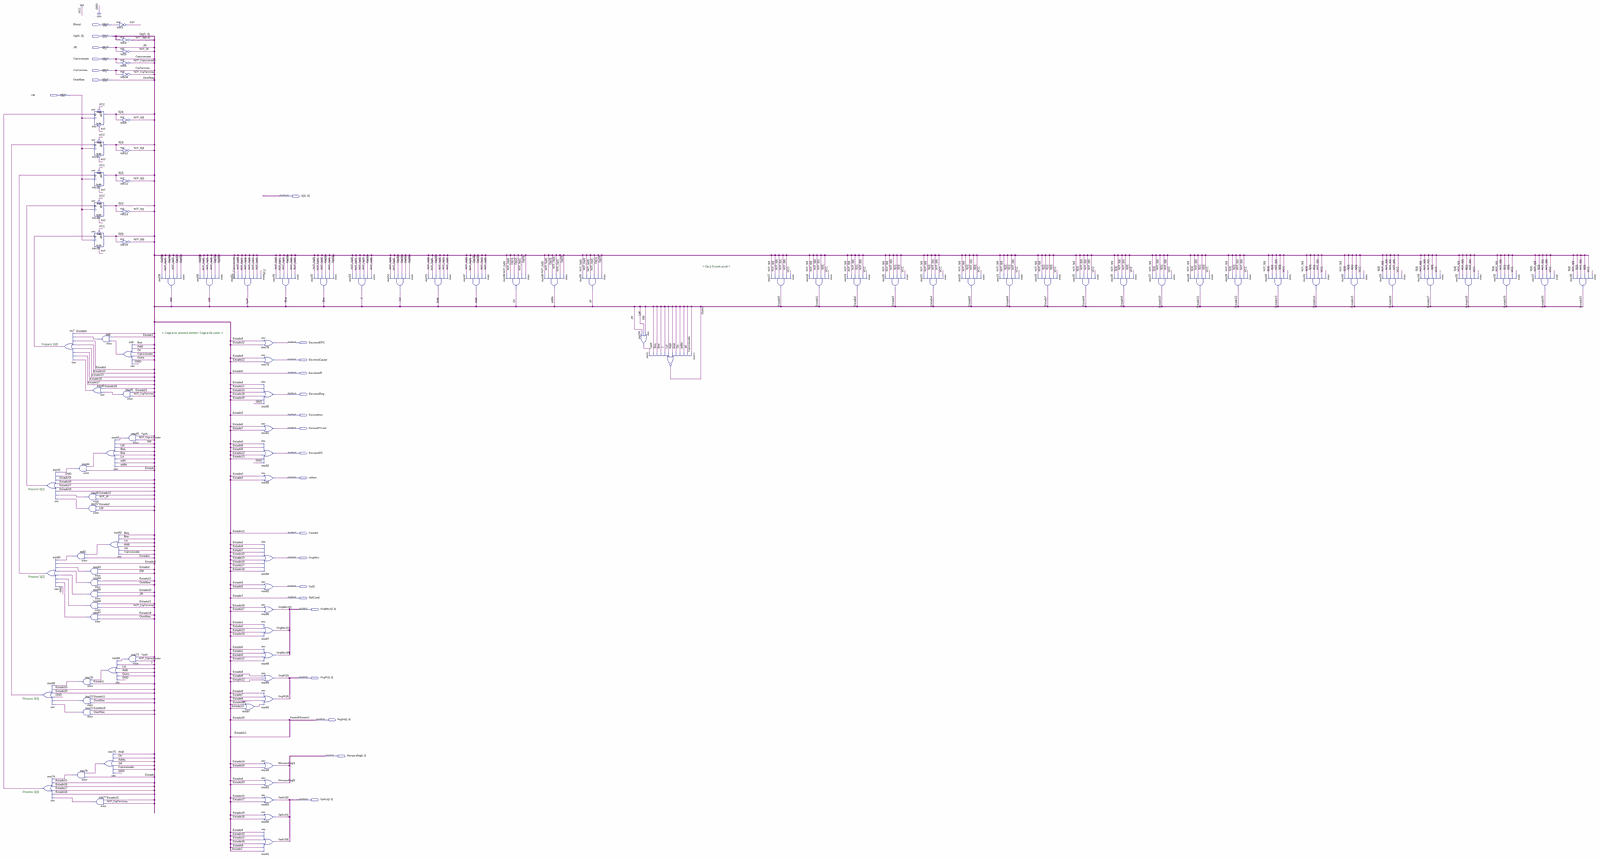
[diagram p0: schematic sheet, whole]
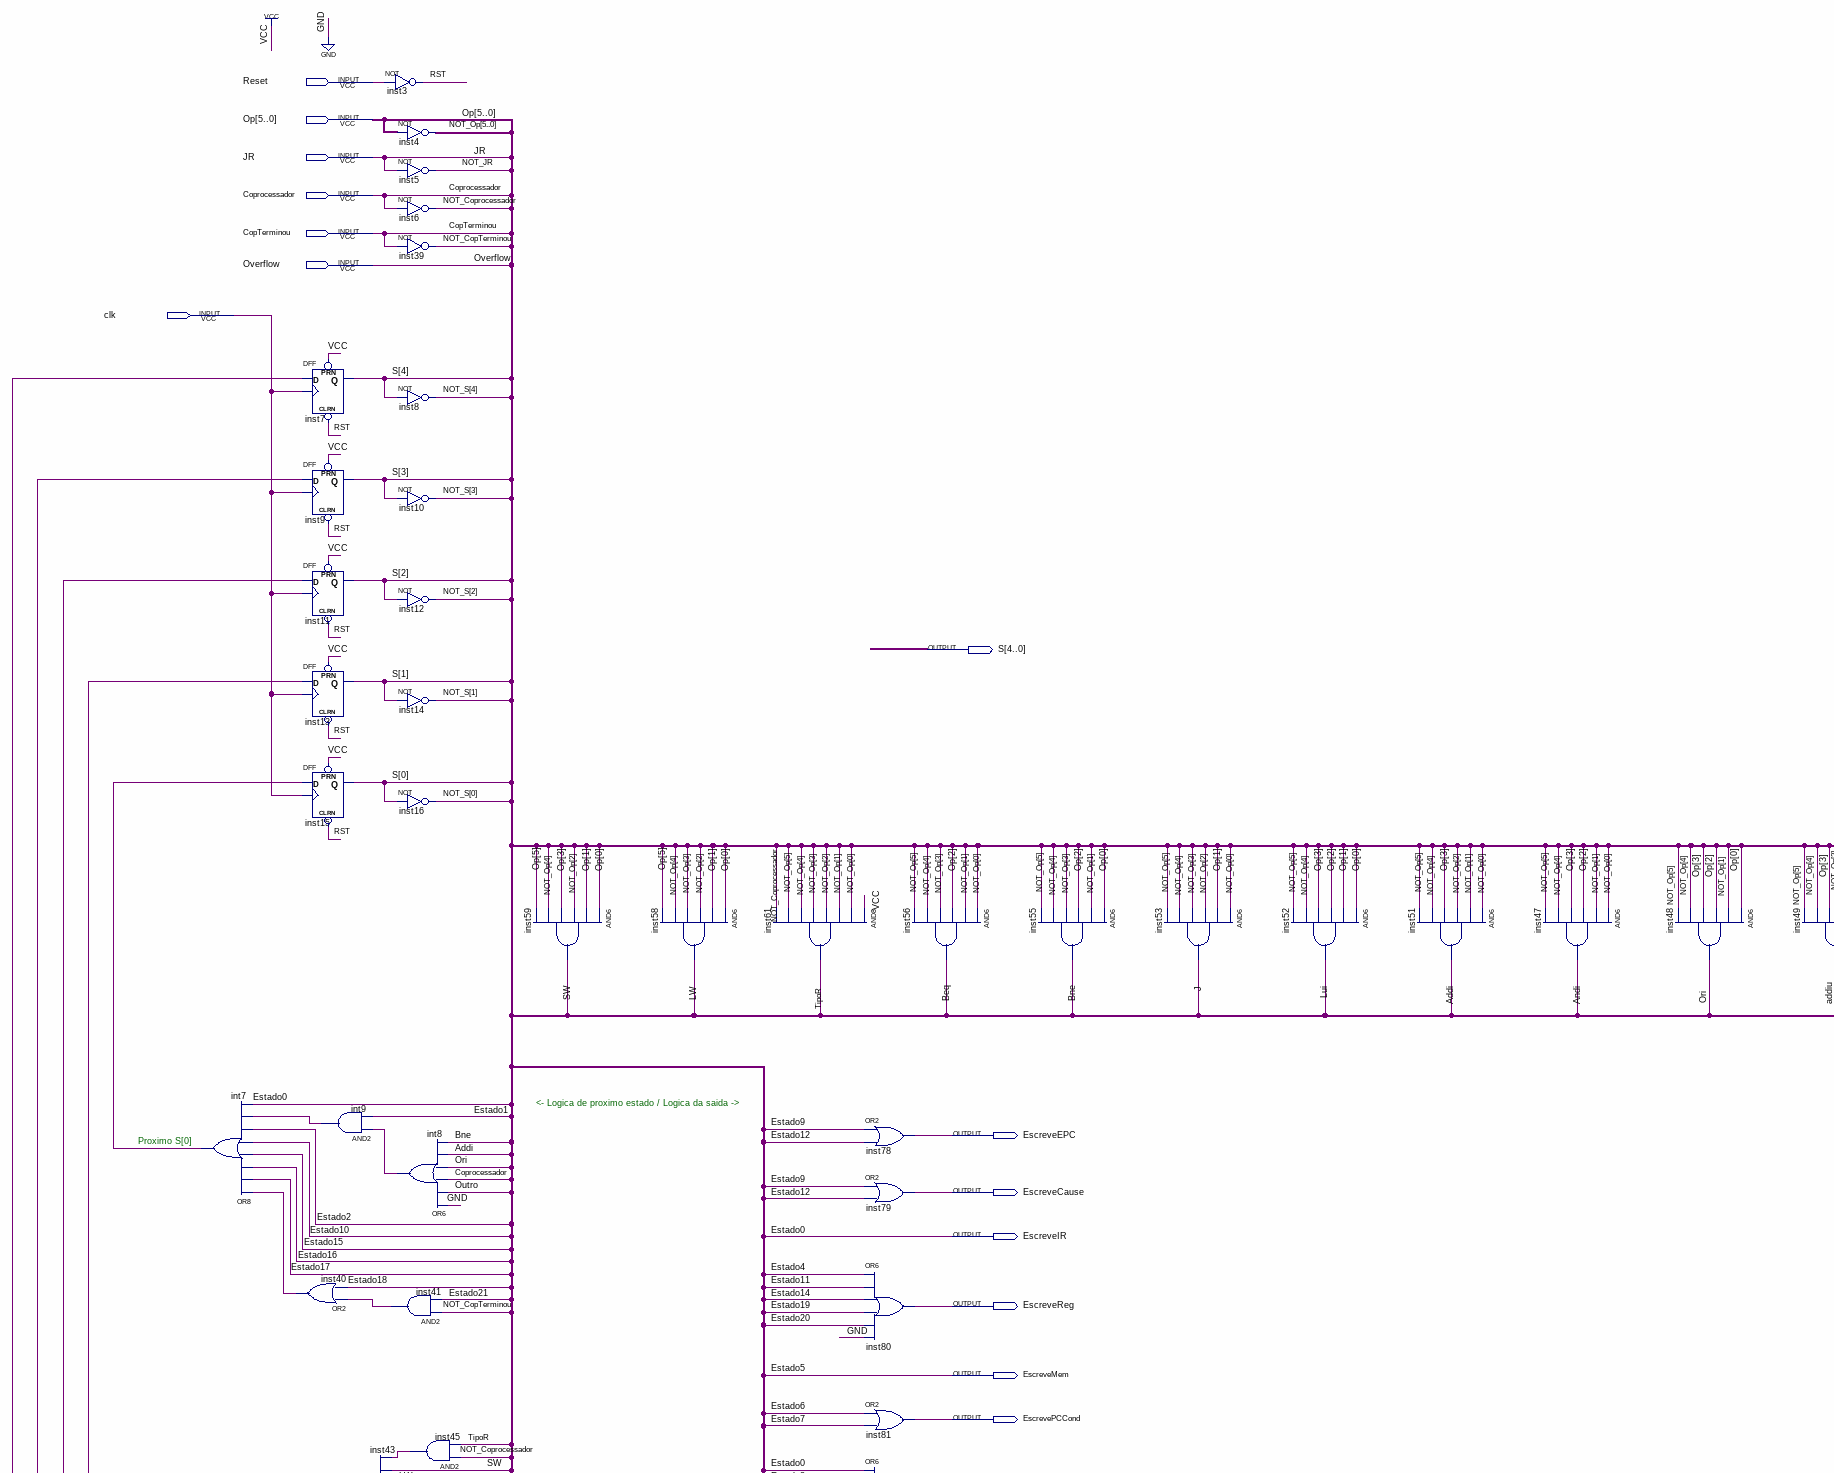
[diagram p1: schematic sheet, upper left part]
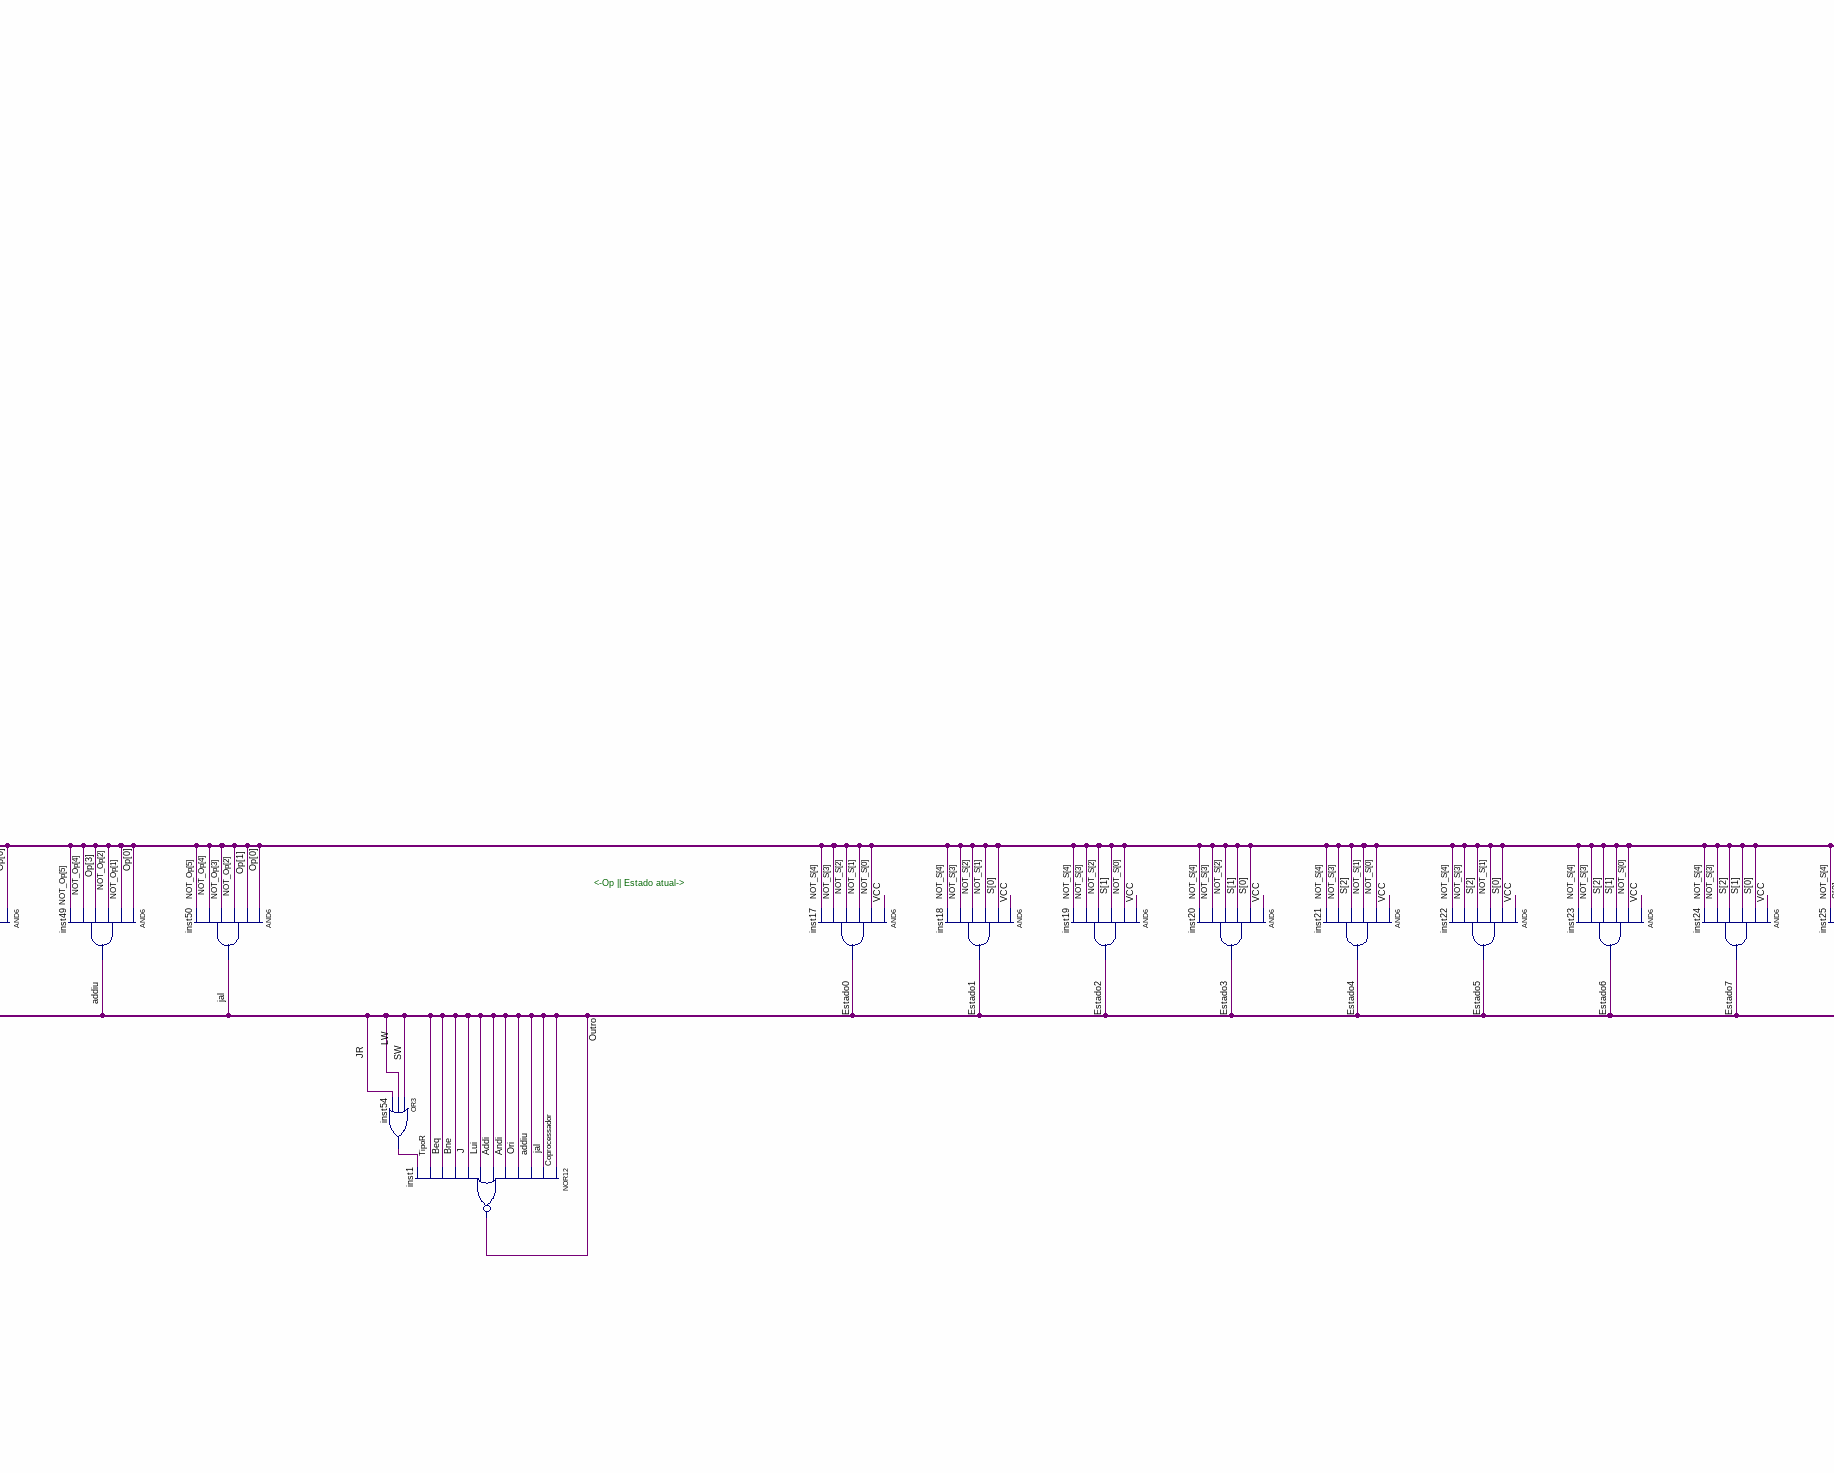
[diagram p2: schematic sheet, upper centre part]
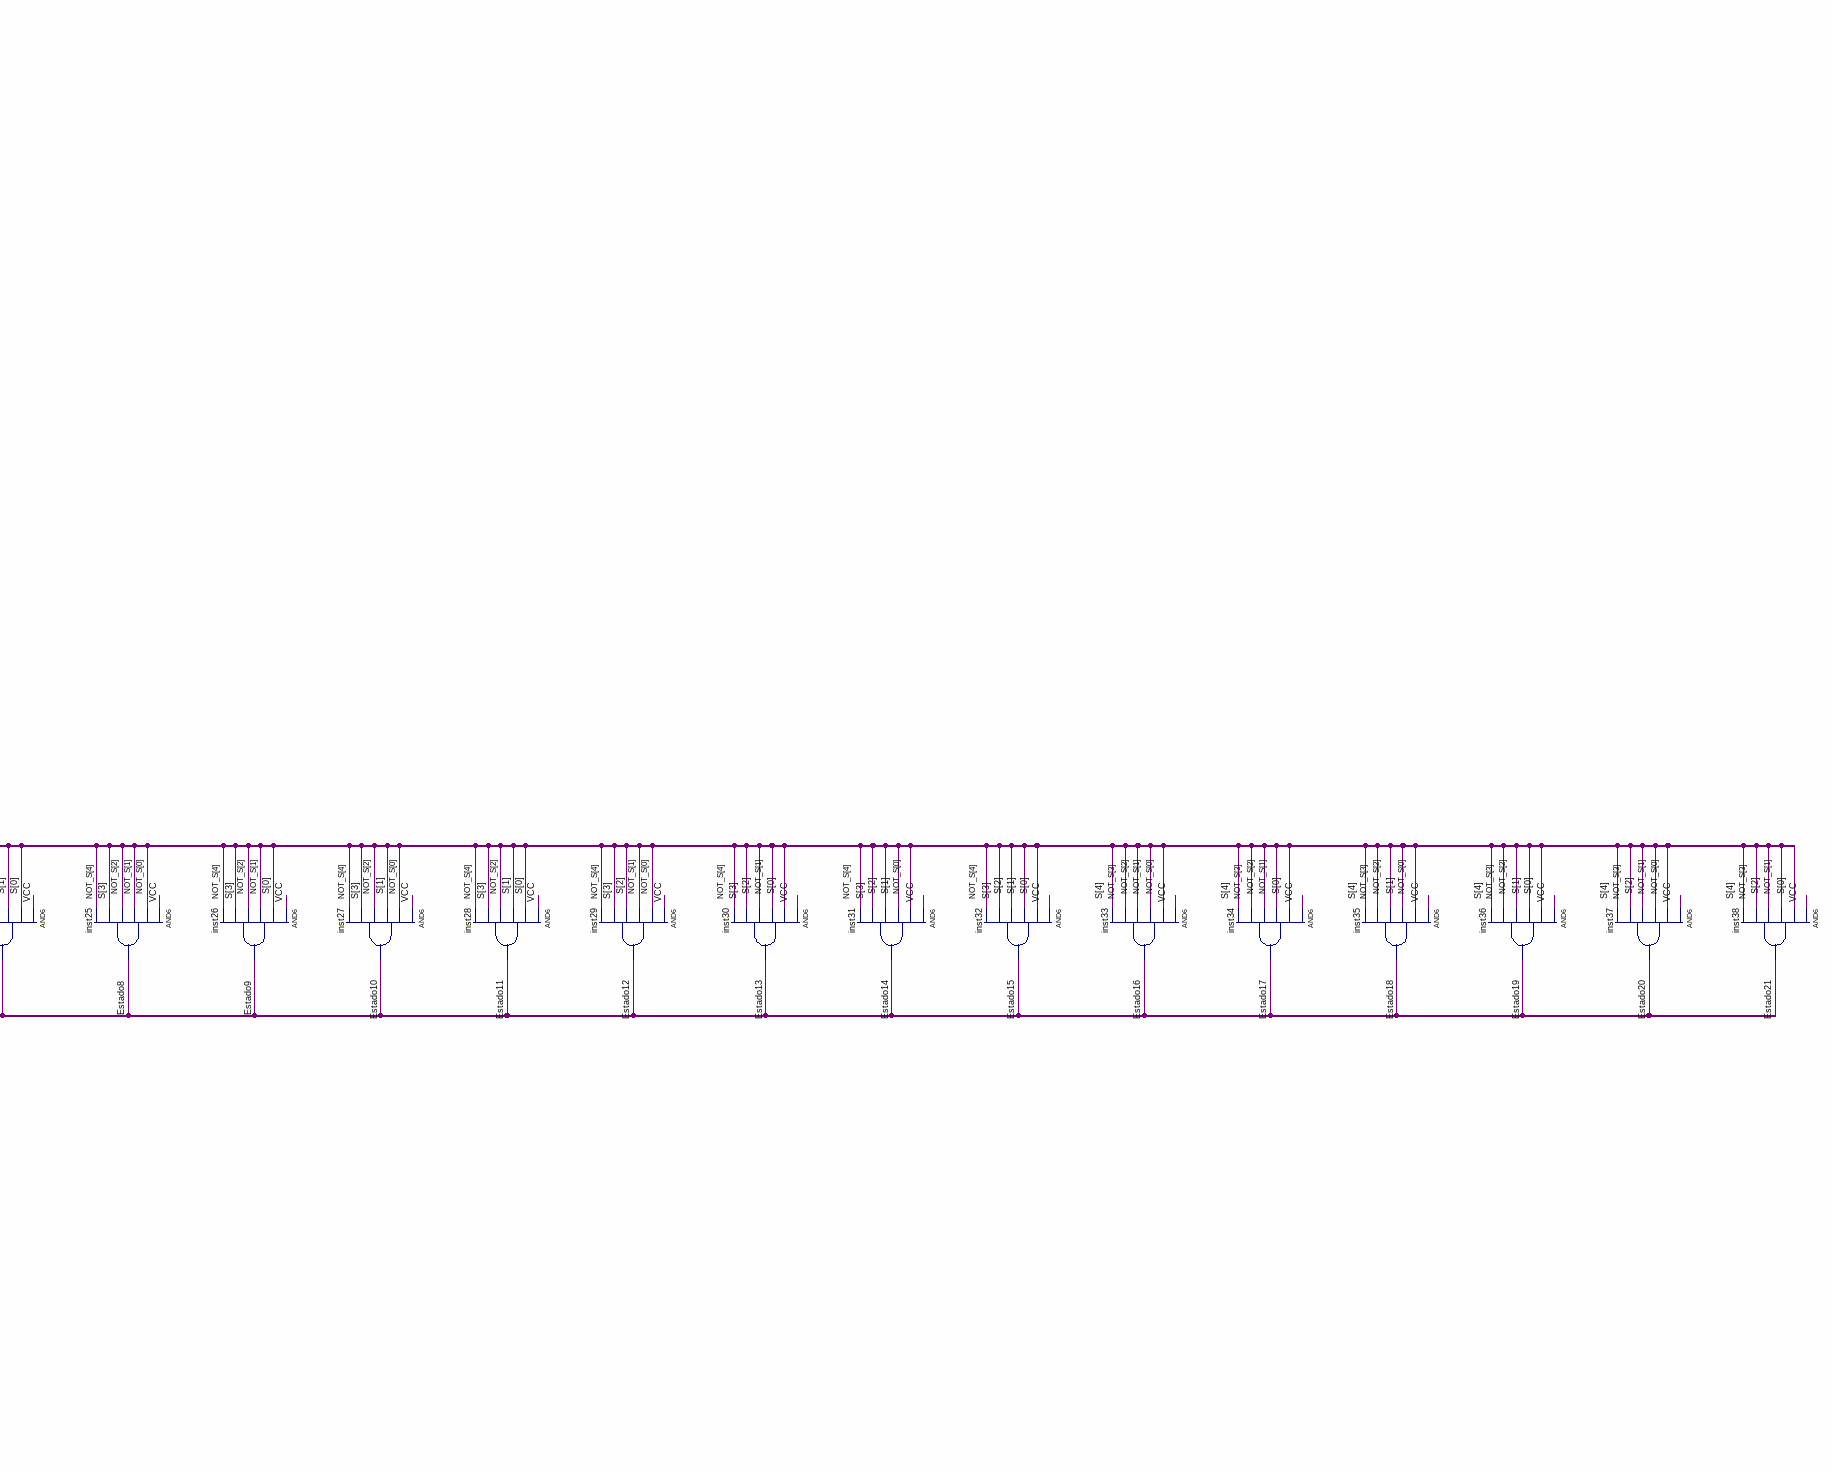
[diagram p3: schematic sheet, upper right part]
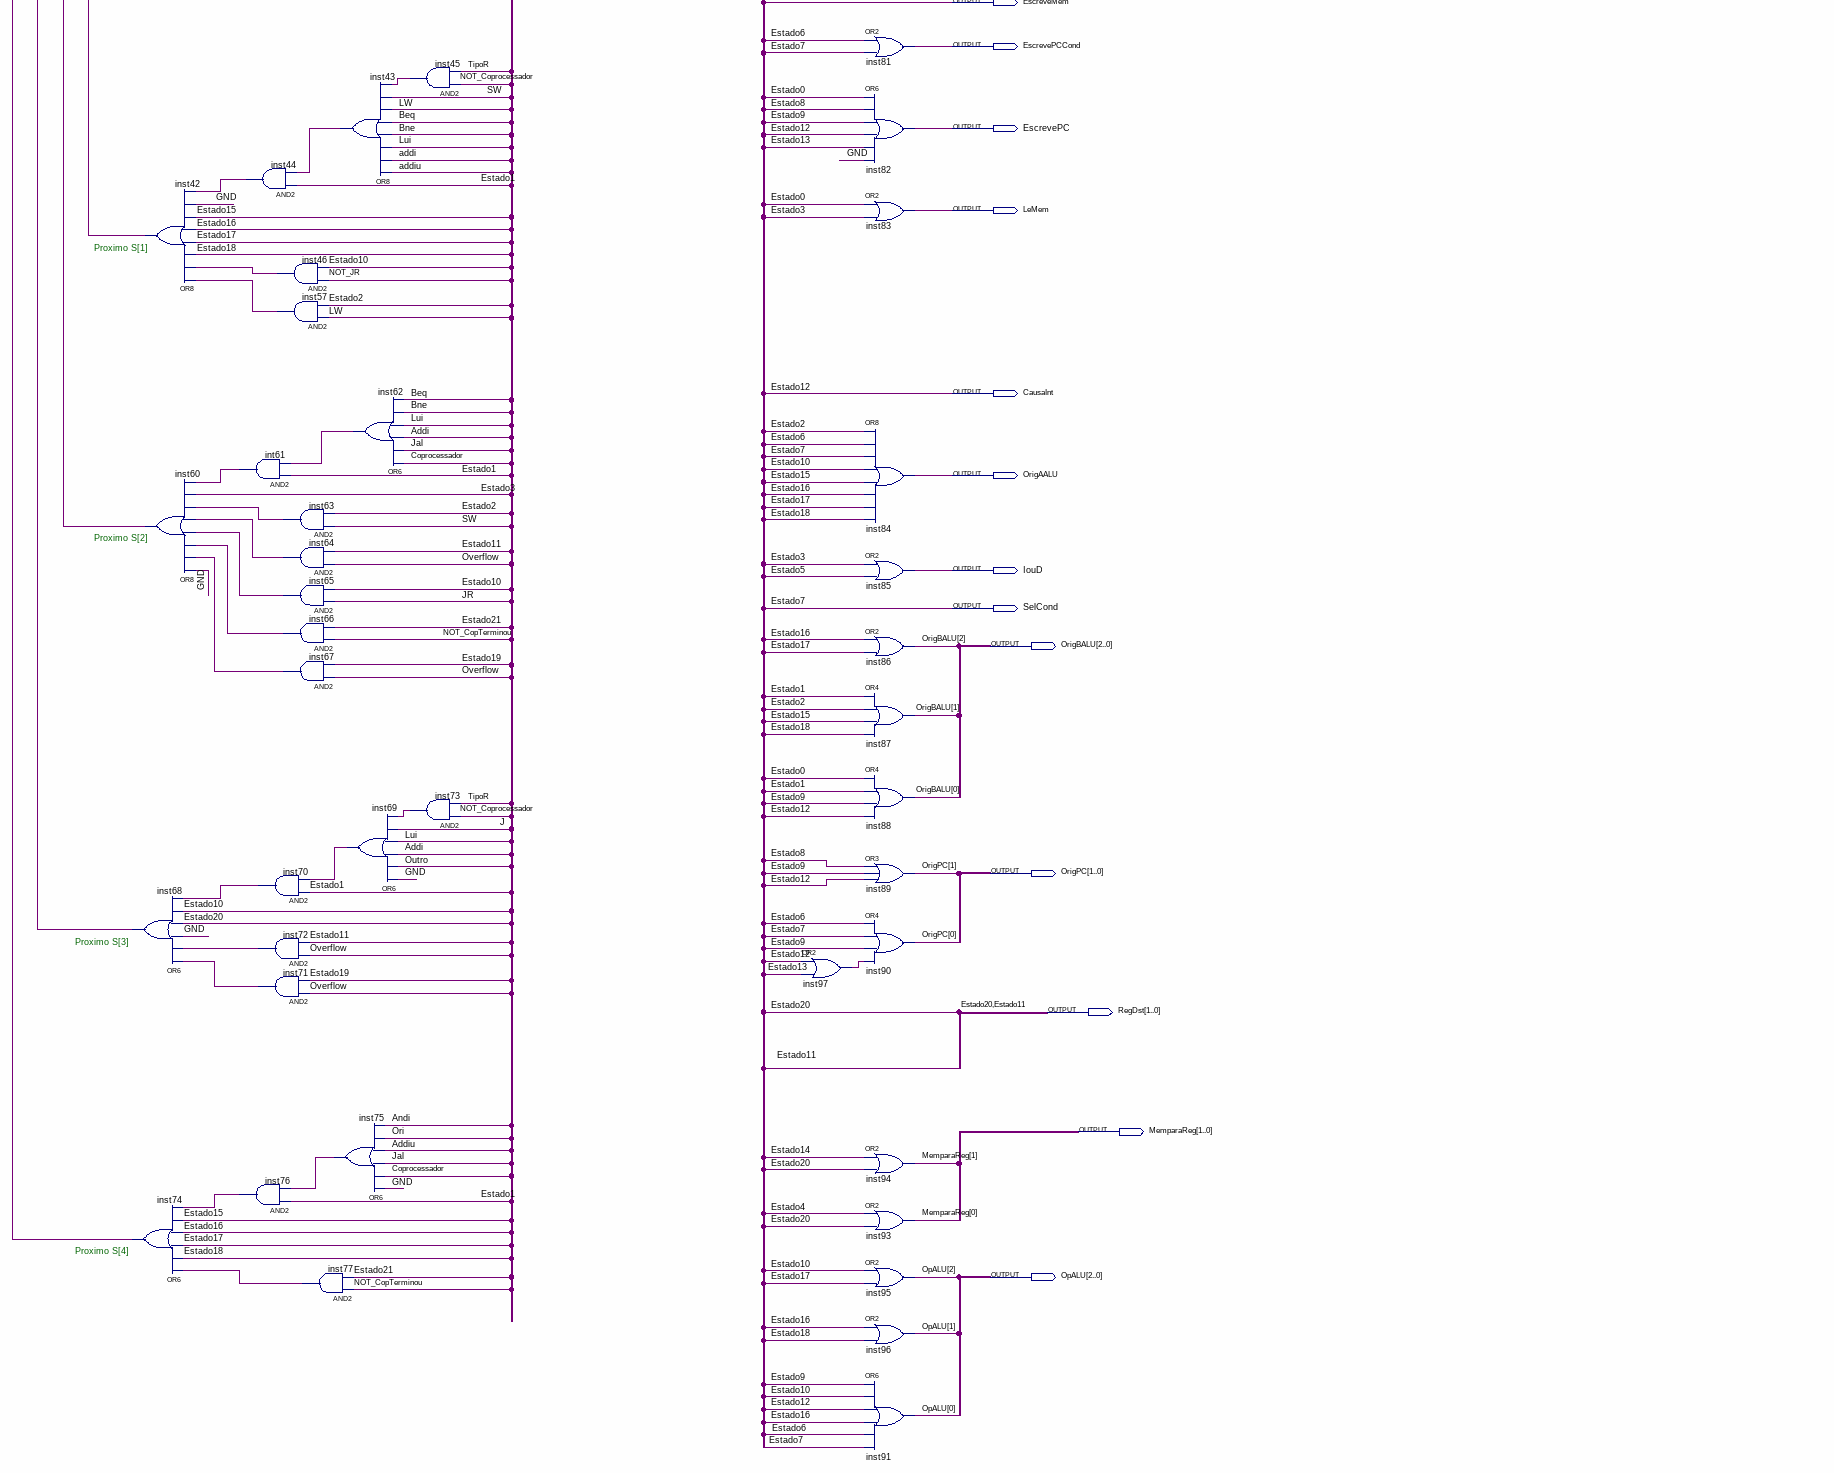
[diagram p4: schematic sheet, lower left part]
// Quartus schematic Controle.bdf as structural Verilog: 99 symbols, 25 pins
module Controle (
  input  Reset,
  input  [5:0] Op,
  input  JR,
  input  Coprocessador,
  input  CopTerminou,
  input  Overflow,
  input  clk,
  output [4:0] S,
  output EscreveEPC,
  output EscreveCause,
  output EscreveIR,
  output EscreveReg,
  output EscreveMem,
  output EscrevePCCond,
  output EscrevePC,
  output LeMem,
  output CausaInt,
  output OrigAALU,
  output IouD,
  output SelCond,
  output [2:0] OrigBALU,
  output [1:0] OrigPC,
  output [1:0] RegDst,
  output [1:0] MemparaReg,
  output [2:0] OpALU
);

  wire Addi, addiu, Andi, Beq, Bne, Estado1, Estado2, Estado3, Estado4, Estado6, Estado8, Estado9, Estado10,
       Estado13, Estado14, Estado15, Estado16, Estado17, Estado18, Estado19, Estado21, inst40_out,
       inst41_out, inst42_out, inst43_out, inst44_out, inst45_out, inst46_out, inst54_out, inst57_out,
       inst60_out, inst62_out, inst63_out, inst64_out, inst65_out, inst66_out, inst67_out, inst68_out,
       inst69_out, inst70_out, inst71_out, inst72_out, inst73_out, inst74_out, inst75_out, inst76_out,
       inst77_out, inst97_out, int7_out, int8_out, int9_out, int61_out, J, jal, Lui, LW, NOT_Coprocessador,
       NOT_CopTerminou, NOT_JR, Ori, Outro, RST, SW, TipoR;
  wire [4:0] NOT_S;
  wire [5:0] NOT_Op;

  or inst42 (inst42_out, inst57_out, inst46_out, Estado18, Estado17, Estado16, Estado15, 1'b0, inst44_out);
  or inst60 (inst60_out, 1'b0, inst67_out, inst66_out, inst65_out, inst64_out, inst63_out, Estado3, int61_out);
  or inst68 (inst68_out, inst71_out, inst72_out, 1'b0, RegDst[1], Estado10, inst70_out);
  or inst74 (inst74_out, inst77_out, Estado18, Estado17, Estado16, Estado15, inst76_out);
  or int7 (int7_out, inst40_out, Estado17, Estado16, Estado15, Estado10, Estado2, int9_out, EscreveIR);
  and inst44 (inst44_out, Estado1, inst43_out);
  and int61 (int61_out, Estado1, inst62_out);
  and inst76 (inst76_out, Estado1, inst75_out);
  DFF inst7 (.CLRN(RST), .CLK(clk), .D(inst74_out), .PRN(1'b1), .Q(S[4]));
  DFF inst9 (.CLRN(RST), .CLK(clk), .D(inst68_out), .PRN(1'b1), .Q(S[3]));
  DFF inst11 (.CLRN(RST), .CLK(clk), .D(inst60_out), .PRN(1'b1), .Q(S[2]));
  DFF inst13 (.CLRN(RST), .CLK(clk), .D(inst42_out), .PRN(1'b1), .Q(S[1]));
  DFF inst15 (.CLRN(RST), .CLK(clk), .D(int7_out), .PRN(1'b1), .Q(S[0]));
  or inst40 (inst40_out, inst41_out, Estado18);
  and inst46 (inst46_out, NOT_JR, Estado10);
  and inst57 (inst57_out, LW, Estado2);
  and inst63 (inst63_out, SW, Estado2);
  and inst64 (inst64_out, Overflow, RegDst[0]);
  and inst65 (inst65_out, JR, Estado10);
  and inst66 (inst66_out, NOT_CopTerminou, Estado21);
  and inst67 (inst67_out, Overflow, Estado19);
  and inst70 (inst70_out, Estado1, inst69_out);
  and inst72 (inst72_out, Overflow, RegDst[0]);
  and inst71 (inst71_out, Overflow, Estado19);
  and inst77 (inst77_out, NOT_CopTerminou, Estado21);
  and int9 (int9_out, int8_out, Estado1);
  or inst43 (inst43_out, addiu, Addi, Lui, Bne, Beq, LW, SW, inst45_out);
  or inst62 (inst62_out, Coprocessador, jal, Addi, Lui, Bne, Beq);
  or inst69 (inst69_out, 1'b0, Outro, Addi, Lui, J, inst73_out);
  or inst75 (inst75_out, 1'b0, Coprocessador, jal, addiu, Ori, Andi);
  not inst3 (RST, Reset);
  assign NOT_Op = ~Op;  // NOT inst4, 6 bits wide
  not inst5 (NOT_JR, JR);
  not inst6 (NOT_Coprocessador, Coprocessador);
  not inst39 (NOT_CopTerminou, CopTerminou);
  not inst8 (NOT_S[4], S[4]);
  not inst10 (NOT_S[3], S[3]);
  not inst12 (NOT_S[2], S[2]);
  not inst14 (NOT_S[1], S[1]);
  not inst16 (NOT_S[0], S[0]);
  or int8 (int8_out, 1'b0, Outro, Coprocessador, Ori, Addi, Bne);
  and inst41 (inst41_out, NOT_CopTerminou, Estado21);
  and inst45 (inst45_out, NOT_Coprocessador, TipoR);
  and inst73 (inst73_out, NOT_Coprocessador, TipoR);
  and inst59 (SW, Op[0], Op[1], NOT_Op[2], Op[3], NOT_Op[4], Op[5]);
  and inst58 (LW, Op[0], Op[1], NOT_Op[2], NOT_Op[3], NOT_Op[4], Op[5]);
  and inst61 (TipoR, 1'b1, NOT_Op[0], NOT_Op[1], NOT_Op[2], NOT_Op[3], NOT_Op[4], NOT_Op[5], NOT_Coprocessador);
  or inst97 (inst97_out, CausaInt, Estado13);
  and inst56 (Beq, NOT_Op[0], NOT_Op[1], Op[2], NOT_Op[3], NOT_Op[4], NOT_Op[5]);
  or inst78 (EscreveEPC, Estado9, CausaInt);
  or inst79 (EscreveCause, Estado9, CausaInt);
  or inst80 (EscreveReg, Estado4, RegDst[0], Estado14, Estado19, RegDst[1], 1'b0);
  or inst81 (EscrevePCCond, Estado6, SelCond);
  or inst82 (EscrevePC, EscreveIR, Estado8, Estado9, CausaInt, Estado13, 1'b0);
  or inst83 (LeMem, EscreveIR, Estado3);
  or inst84 (OrigAALU, Estado2, Estado6, SelCond, Estado10, Estado15, Estado16, Estado17, Estado18);
  or inst85 (IouD, Estado3, EscreveMem);
  or inst86 (OrigBALU[2], Estado16, Estado17);
  or inst87 (OrigBALU[1], Estado1, Estado2, Estado15, Estado18);
  or inst88 (OrigBALU[0], EscreveIR, Estado1, Estado9, CausaInt);
  or inst89 (OrigPC[1], Estado8, Estado9, CausaInt);
  or inst90 (OrigPC[0], Estado6, SelCond, Estado9, inst97_out);
  or inst94 (MemparaReg[1], Estado14, RegDst[1]);
  or inst93 (MemparaReg[0], Estado4, RegDst[1]);
  or inst95 (OpALU[2], Estado10, Estado17);
  or inst96 (OpALU[1], Estado16, Estado18);
  or inst91 (OpALU[0], Estado9, Estado10, CausaInt, Estado16, Estado6, SelCond);
  and inst55 (Bne, Op[0], NOT_Op[1], Op[2], NOT_Op[3], NOT_Op[4], NOT_Op[5]);
  and inst53 (J, NOT_Op[0], Op[1], NOT_Op[2], NOT_Op[3], NOT_Op[4], NOT_Op[5]);
  and inst52 (Lui, Op[0], Op[1], Op[2], Op[3], NOT_Op[4], NOT_Op[5]);
  and inst51 (Addi, NOT_Op[0], NOT_Op[1], NOT_Op[2], Op[3], NOT_Op[4], NOT_Op[5]);
  and inst47 (Andi, NOT_Op[0], NOT_Op[1], Op[2], Op[3], NOT_Op[4], NOT_Op[5]);
  and inst48 (Ori, Op[0], NOT_Op[1], Op[2], Op[3], NOT_Op[4], NOT_Op[5]);
  and inst49 (addiu, Op[0], NOT_Op[1], NOT_Op[2], Op[3], NOT_Op[4], NOT_Op[5]);
  and inst50 (jal, Op[0], Op[1], NOT_Op[2], NOT_Op[3], NOT_Op[4], NOT_Op[5]);
  or inst54 (inst54_out, SW, LW, JR);
  nor inst1 (Outro, Coprocessador, jal, addiu, Ori, Andi, Addi, Lui, J, Bne, Beq, TipoR, inst54_out);
  and inst17 (EscreveIR, 1'b1, NOT_S[0], NOT_S[1], NOT_S[2], NOT_S[3], NOT_S[4]);
  and inst18 (Estado1, 1'b1, S[0], NOT_S[1], NOT_S[2], NOT_S[3], NOT_S[4]);
  and inst19 (Estado2, 1'b1, NOT_S[0], S[1], NOT_S[2], NOT_S[3], NOT_S[4]);
  and inst20 (Estado3, 1'b1, S[0], S[1], NOT_S[2], NOT_S[3], NOT_S[4]);
  and inst21 (Estado4, 1'b1, NOT_S[0], NOT_S[1], S[2], NOT_S[3], NOT_S[4]);
  and inst22 (EscreveMem, 1'b1, S[0], NOT_S[1], S[2], NOT_S[3], NOT_S[4]);
  and inst23 (Estado6, 1'b1, NOT_S[0], S[1], S[2], NOT_S[3], NOT_S[4]);
  and inst24 (SelCond, 1'b1, S[0], S[1], S[2], NOT_S[3], NOT_S[4]);
  and inst25 (Estado8, 1'b1, NOT_S[0], NOT_S[1], NOT_S[2], S[3], NOT_S[4]);
  and inst26 (Estado9, 1'b1, S[0], NOT_S[1], NOT_S[2], S[3], NOT_S[4]);
  and inst27 (Estado10, 1'b1, NOT_S[0], S[1], NOT_S[2], S[3], NOT_S[4]);
  and inst28 (RegDst[0], 1'b1, S[0], S[1], NOT_S[2], S[3], NOT_S[4]);
  and inst29 (CausaInt, 1'b1, NOT_S[0], NOT_S[1], S[2], S[3], NOT_S[4]);
  and inst30 (Estado13, 1'b1, S[0], NOT_S[1], S[2], S[3], NOT_S[4]);
  and inst31 (Estado14, 1'b1, NOT_S[0], S[1], S[2], S[3], NOT_S[4]);
  and inst32 (Estado15, 1'b1, S[0], S[1], S[2], S[3], NOT_S[4]);
  and inst33 (Estado16, 1'b1, NOT_S[0], NOT_S[1], NOT_S[2], NOT_S[3], S[4]);
  and inst34 (Estado17, 1'b1, S[0], NOT_S[1], NOT_S[2], NOT_S[3], S[4]);
  and inst35 (Estado18, 1'b1, NOT_S[0], S[1], NOT_S[2], NOT_S[3], S[4]);
  and inst36 (Estado19, 1'b1, S[0], S[1], NOT_S[2], NOT_S[3], S[4]);
  and inst37 (RegDst[1], 1'b1, NOT_S[0], NOT_S[1], S[2], NOT_S[3], S[4]);
  and inst38 (Estado21, 1'b1, S[0], NOT_S[1], S[2], NOT_S[3], S[4]);

  // Other names for the same wires on the sheet: Estado0 = EscreveIR; Estado5 = EscreveMem; Estado7 = SelCond;
  //   Estado11 = RegDst[0]; Estado12 = CausaInt; Estado20 = RegDst[1]

  // Notes on the sheet:
  //   <-Op || Estado atual->
  //   <- Logica de proximo estado / Logica da saida ->
  //   Proximo S[0]
  //   Proximo S[1]
  //   Proximo S[2]
  //   Proximo S[3]
  //   Proximo S[4]
endmodule
